# Altium schematic sheet bncs.SchDoc: Hall / Main Board / BNCs
size A4; DocumentNumber: 2; SheetNumber: 2; SheetTotal: 7
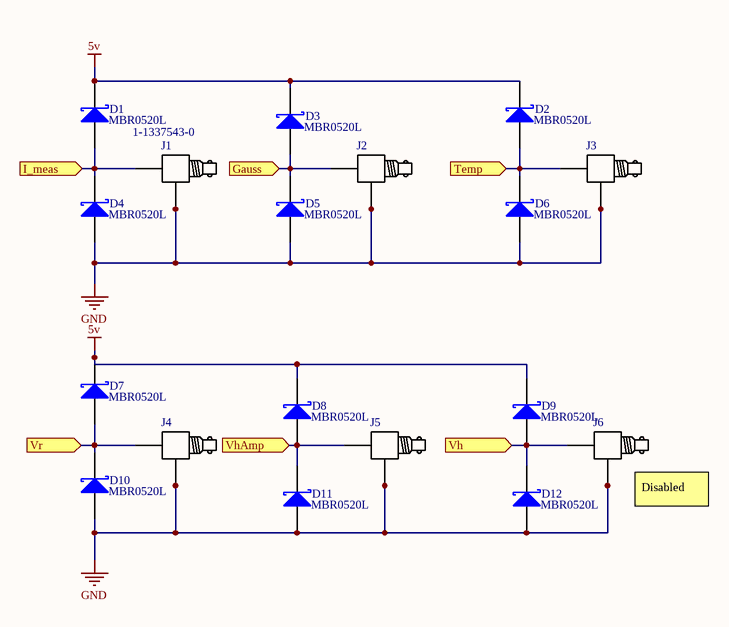
[diagram p0: bncs.SchDoc]

## Parts
D1  Supplier Part Number 1: MBR0520L  [SOD123]
D2  Supplier Part Number 1: MBR0520L  [SOD123]
D3  Supplier Part Number 1: MBR0520L  [SOD123]
D4  Supplier Part Number 1: MBR0520L  [SOD123]
D5  Supplier Part Number 1: MBR0520L  [SOD123]
D6  Supplier Part Number 1: MBR0520L  [SOD123]
D7  Supplier Part Number 1: MBR0520L  [SOD123]
D8  Supplier Part Number 1: MBR0520L  [SOD123]
D9  Supplier Part Number 1: MBR0520L  [SOD123]
D10  Supplier Part Number 1: MBR0520L  [SOD123]
D11  Supplier Part Number 1: MBR0520L  [SOD123]
D12  Supplier Part Number 1: MBR0520L  [SOD123]
J1  Supplier Part Number 1: 1-1337543-0  [BNC-RA]
J2  (no value)  [BNC-RA]
J3  (no value)  [BNC-RA]
J4  (no value)  [BNC-RA]
J5  (no value)  [BNC-RA]
J6  (no value)  [BNC-RA]

## Ports
Gauss (in), I_meas (in), Temp (in), Vh (in), VhAmp (in), Vr (in)

## Nets
5v: D1.K D2.K D3.K D7.K D8.K D9.K
GND: D4.A D5.A D6.A D10.A D11.A D12.A J1.2(gnd) J1.A J1.B J2.2(gnd) J2.A J2.B J3.2(gnd) J3.A J3.B J4.2(gnd) J4.A J4.B J5.2(gnd) J5.A J5.B J6.2(gnd) J6.A J6.B
Gauss: D3.A D5.K J2.1 ; port Gauss
I_meas: D1.A D4.K J1.1 ; port I_meas
Temp: D2.A D6.K J3.1 ; port Temp
Vh: D9.A D12.K J6.1 ; port Vh
VhAmp: D8.A D11.K J5.1 ; port VhAmp
Vr: D7.A D10.K J4.1 ; port Vr

## Notes on the sheet
- (near J6) Disabled
- Title
- Size:
- Date:
- A4
- Number:
- Time:
- Revision:
- Sheet
- of
- Fermium LABS srl
- Via Monselice 15a
- 35142 Padova PD
- Italy
- File:

## Library data of the parts
D1-D9 D11 D12 = D Schottky: Schottky Diode; Manufacturer: FAIRCHILD SEMICONDUCTOR; Unit: pcs; SuppliedAmount: 0; MinAmount: 10; Multiples: 1; Diode type: Schottky rectifying; Off state voltage max.: 20V; Forward voltage at If: 390mV; Load current: 500mA; Pads: 2 SMD; Published: 8-Jun-2000; LatestRevisionDate: 17-Jul-2002; LatestRevisionNote: Re-released for DXP Platform.; PackageReference: SMB; Publisher: Altium Limited; PackageDescription: DO-214-AA/SMB; 2 C-Bend Leads; Body 5.3 x 3.6 mm, inc. leads (LxW); Code_JEDEC: DO-214-AA; Supplier 1: TME; Manufacturer Part Number: MBR0520L; Category: SMD Schottky Diodes; Stock 1: 24595; Pricing 1: 10=0.0403, 50=0.0376, 250=0.0333, 1000=0.03, 3000=0.0281 (EUR); Weight: 0.032; Case: SOD123; Mounting: SMD; Price Type: NET; ComponentLink1URL: http://static.tme.eu/products_pics/e/d/b/edbd030cb344fc64745afa0f91101952/285567.jpg; ComponentLink1Description: http://static.tme.eu/products_pics/e/d/b/edbd030cb344fc64745afa0f91101952/285567.jpg
D10 = D Schottky: Schottky Diode; Manufacturer: FAIRCHILD SEMICONDUCTOR; Unit: pcs; SuppliedAmount: 0; MinAmount: 10; Multiples: 1; Diode type: Schottky rectifying; Off state voltage max.: 20V; Forward voltage at If: 390mV; Load current: 500mA; 2: SMD; Pads: 2 SMD; Published: 8-Jun-2000; LatestRevisionDate: 17-Jul-2002; LatestRevisionNote: Re-released for DXP Platform.; PackageReference: SMB; Publisher: Altium Limited; PackageDescription: DO-214-AA/SMB; 2 C-Bend Leads; Body 5.3 x 3.6 mm, inc. leads (LxW); Code_JEDEC: DO-214-AA; Supplier 1: TME; Manufacturer Part Number: MBR0520L; Category: SMD Schottky Diodes; Stock 1: 24595; Pricing 1: 10=0.0403, 50=0.0376, 250=0.0333, 1000=0.03, 3000=0.0281 (EUR); Weight: 0.032; Case: SOD123; Mounting: SMD; Price Type: NET; ComponentLink1URL: http://static.tme.eu/products_pics/e/d/b/edbd030cb344fc64745afa0f91101952/285567.jpg; ComponentLink1Description: http://static.tme.eu/products_pics/e/d/b/edbd030cb344fc64745afa0f91101952/285567.jpg
J1 = BNC-PCB-RA: connector bnc; Manufacturer: TE CONNECTIVITY; Unit: pcs; SuppliedAmount: 0; MinAmount: 1; Connector: socket; Connector variant: insulated; Spatial orientation: angled 90°; Wave impedance: 50Ω; Electrical mounting: THT; Mechanical mounting: on PCBs; Insulator material: polyester; Pads: 4 THT; Supplier 1: TME; Manufacturer Part Number: 1-1337543-0; Category: BNC connectors; Stock 1: 44; Pricing 1: 1=1.22, 25=1.1, 100=0.98, 1000=0.86 (EUR); Weight: 13.22; Multiples: 1; Connector type: BNC; Contact plating: gold plated; Price Type: NET; ComponentLink1URL: http://static.tme.eu/products_pics/6/3/2/63240353f8a8790dbe8f7bd93b014c1a/378606.jpg; ComponentLink1Description: http://static.tme.eu/products_pics/6/3/2/63240353f8a8790dbe8f7bd93b014c1a/378606.jpg
J2-J6 = BNC-PCB-RA: connector bnc; Manufacturer: TE CONNECTIVITY; Manufacturer Part Number: 1-1337543-0; Unit: pcs; SuppliedAmount: 0; MinAmount: 1; Connector: socket; Connector variant: insulated; Spatial orientation: angled 90°; Wave impedance: 50Ω; Electrical mounting: THT; Mechanical mounting: on PCBs; Insulator material: polyester; Pads: 4 THT; Supplier 1: TME; Supplier Part Number 1: 1-1337543-0; Category: BNC connectors; Stock 1: 44; Pricing 1: 1=1.22, 25=1.1, 100=0.98, 1000=0.86 (EUR); Weight: 13.22; Multiples: 1; Connector type: BNC; Contact plating: gold plated; Price Type: NET; ComponentLink1URL: http://static.tme.eu/products_pics/6/3/2/63240353f8a8790dbe8f7bd93b014c1a/378606.jpg; ComponentLink1Description: http://static.tme.eu/products_pics/6/3/2/63240353f8a8790dbe8f7bd93b014c1a/378606.jpg